# Altium schematic sheet PAGE19.SchDoc
size 246 x 182 mm
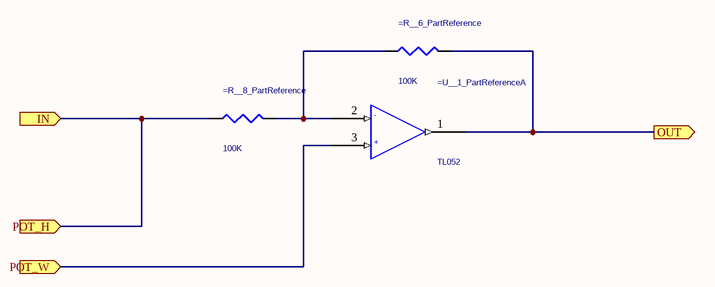
[diagram p0: PAGE19.SchDoc]

## Parts
=R__6_PartReference  100K  [AXIAL0.4]
=R__8_PartReference  100K  [AXIAL0.4]
=U__1_PartReference  TL052  [DIP8]  (part A of 3)

## Ports
IN (in), OUT (out), POT_H (in), POT_W (in)

## Nets
IN: =R__8_PartReference.1 ; port IN, port POT_H
OUT: =R__6_PartReference.2 =U__1_PartReference.1(OUT) ; port OUT
POT_W: =U__1_PartReference.3(+) ; port POT_W
Net=R__6_PartReference_1: =R__6_PartReference.1 =R__8_PartReference.2 =U__1_PartReference.2(-)

## Library data of the parts
=R__6_PartReference =R__8_PartReference = R_Dup1
=U__1_PartReference = GEN DUAL OPAMP-H: PACKAGE: =U__1_PACKAGE